# Altium schematic sheet Sheet1.SchDoc
size 420 x 297 mm; Address1: Address1; Address2: Address2; Address3: Address3; Address4: Address4; SheetNumber: 1; Scale: 1:1; Разраб.: Иванов; Обозначение документа: АБВГ.123456.001 Э3; Пров.: Петров; Утв.: Сидоров; Наименование организации: ОАО "Ваша фирма"; Перв. применение: АБВГ.123456.000; Наименование изделия 1: Плата; Наименование изделия 2: Схема электрическая; Наименование изделия 3: принципиальная; Нач. отд.: Нач. отд.; Фамилия нач. отд.: Сидоров; PageSetup: Record=PageOptions|CenterHorizontal=True|CenterVertical=True|PrintScale=0.94|XCorrection=1.00|YCorrection=1.00|PrintKind=1|BorderSize=5000000|LeftOffset=0|BottomOffset=0|Orientation=1|PaperLength=1000|PaperWidth=1000|Scale=100|PaperSource=7|PrintQuality=-4|MediaType=1|DitherType=10|PaperKind=A4|PrintScaleMode=1; DecimalNumber: Децимальный номер; HeadOfSector: Нач. сектора; MainDevice: Перв.примен.; Name: Наименование
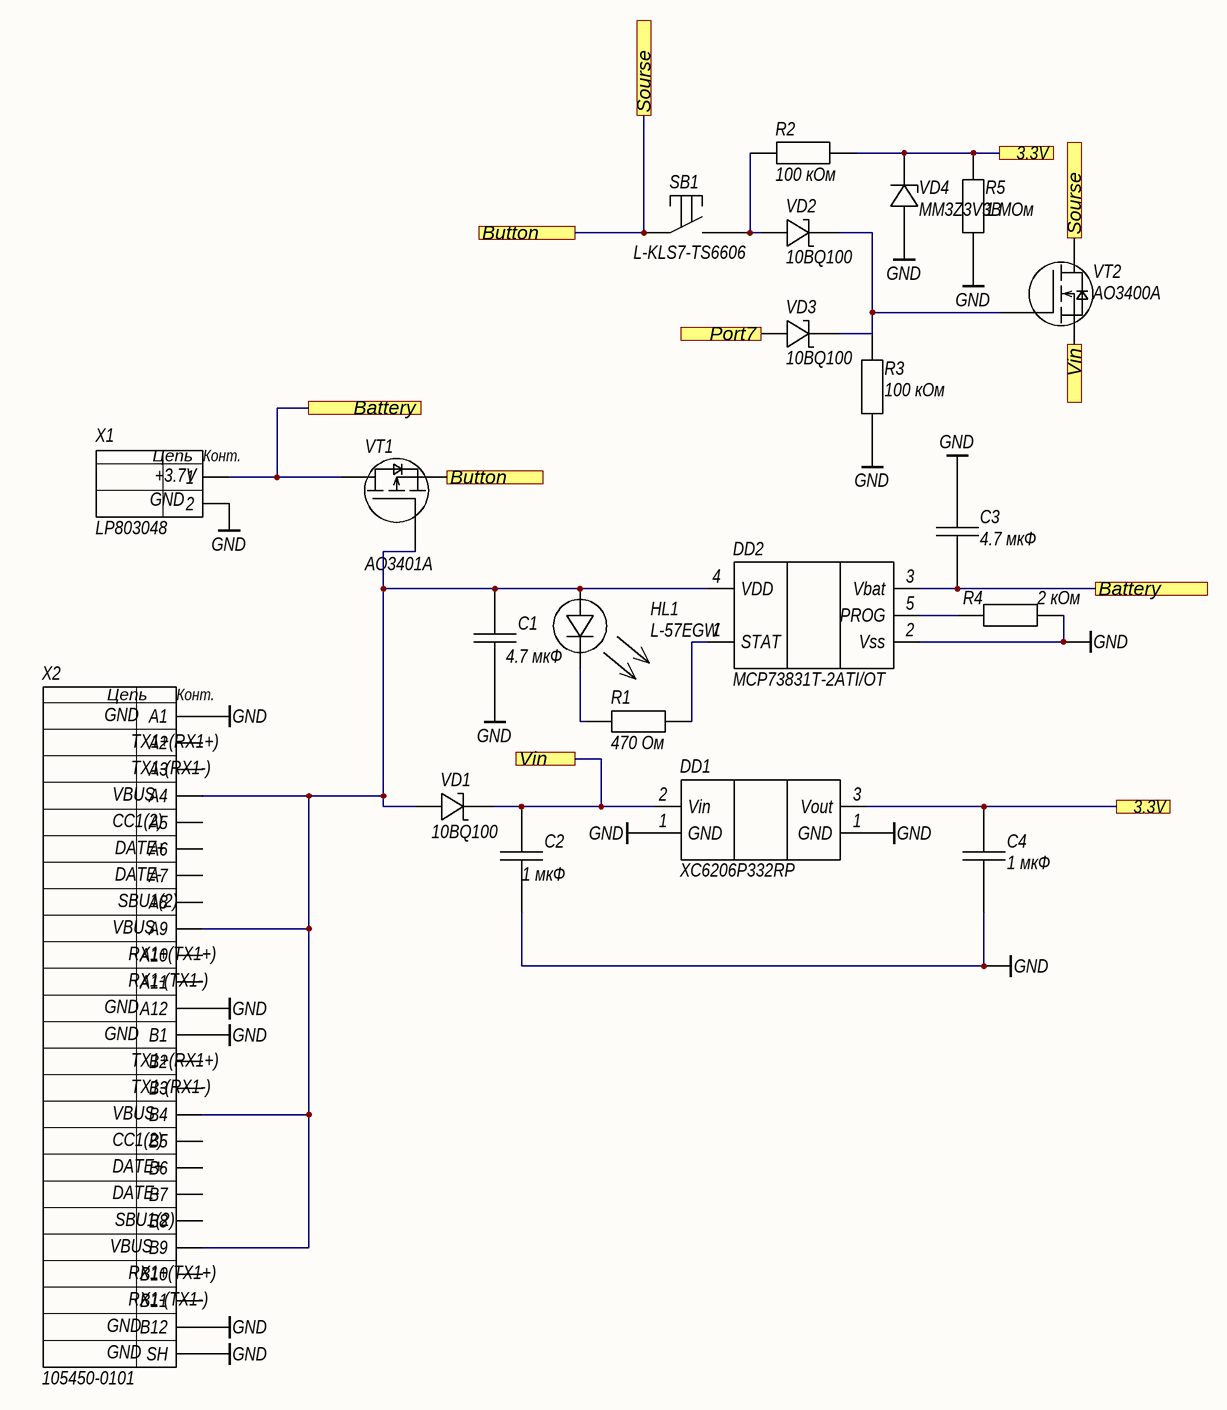
[diagram p0: Sheet1.SchDoc]

## Parts
C1  4.7 мкФ  [CAP_0805]
C2  1 мкФ  [CAP_0805]
C3  4.7 мкФ  [CAP_0805]
C4  1 мкФ  [CAP_0805]
DD1  XC6206P332RP  [SOT-89]
DD2  MCP73831T-2ATI/OT  [SOT-23-5]
HL1  L-57EGW  [LED]
R1  470 Ом  [RES_0603]
R2  100 кОм  [RES_0603]
R3  100 кОм  [RES_0603]
R4  2 кОм  [RES_0603]
R5  1 МОм  [RES_0603]
SB1  L-KLS7-TS6606  [Button]
VD1  10BQ100  [SMB(DIODE)]
VD2  10BQ100  [SMB(DIODE)]
VD3  10BQ100  [SMB(DIODE)]
VD4  MM3Z3V3B  [SOD-323F]
VT1  AO3401A  [SOT-23-3]
VT2  AO3400A  [SOT-23-3]
X1  LP803048  [Raziem2_3mm]
X2  105450-0101  [USB-C]

## Ports
3.3V, Battery, Button, Port7, Sourse, Vin

## Nets
GND: C1.2 C2.2 C3.1 C4.2 DD1.1(GND) DD2.2(Vss) R3.1 R4.2 R5.1 VD4.A X1.2 X2.A1 X2.A12 X2.B1 X2.B12 X2.SH
3.3V: C4.1 DD1.3(Vout) R2.2 R5.2 VD4.K ; port 3.3V
Battery: C3.2 DD2.3(Vbat) VT1.DRAIN X1.1 ; port Battery
Button: SB1.1 VT1.SOURCE VT2.DRAIN ; port Sourse, port Button
Port7: VD3.A ; port Port7
Vin: C2.1 DD1.2(Vin) VD1.K VT2.SOURCE ; port Vin
NetC1_1: C1.1 DD2.4(VDD) HL1.A VD1.A VT1.GATE X2.A4 X2.A9 X2.B4 X2.B9
NetDD2_1: DD2.1(STAT) R1.2
NetDD2_5: DD2.5(PROG) R4.1
NetHL1_K: HL1.K R1.1
NetR2_1: R2.1 SB1.2 VD2.A
NetR3_2: R3.2 VD2.K VD3.K VT2.GATE

Not connected (* = marked no-connect by the designer): X2 A2 A3 A5 A6 A7 A8 A10 A11 B2 B3 B5 B6 B7 B8 B10 B11

## Notes on the sheet
- Перв.примен.
- Справ.№
- Подп. и дата
- Инв.№ дубл.
- Взам.инв.№
- Подп.и дата
- Разраб.
- Изм.
- Лист
- № докум.
- Подп.
- Дата
- Лит.
- Масштаб
- Масса
- Т.контр.
- Пров.
- СХЕМА   ЭЛЕКТРИЧЕСКАЯ
- ПРИНЦИПИАЛЬНАЯ
- Листов
- Инв.№ подл.
- Утв.
- Н.контр.
- Нач.сект.
- Формат  A3
- (in symbol Raziem_2KONTKTA) Цепь; Конт.; +3.7V; GND
- (in symbol Raziem_USB-C) Цепь; Конт.; GND; TX1+(RX1+); TX1-(RX1-); VBUS; CC1(2); DATE+; DATE-; SBU1(2); RX1+(TX1+); RX1-(TX1-)

## Library data of the parts
C1-C4 = Condensator
  C1 C3: Value: 4.7 мкФ
  C2 C4: Value: 1 мкФ
DD1 = Stability_power: Name: XC6206P332RP
DD2 = Control_batery: Name: MCP73831T-2ATI/OT
HL1 = Svetodiode: Color: L-57EGW; Name: L-57EGW
R1-R5 = Rezistor
  R1: Value: 470 Ом
  R2 R3: Value: 100 кОм
  R4: Value: 2 кОм
  R5: Value: 1 МОм
SB1 = Button: Name: L-KLS7-TS6606
VD1-VD3 = Diode_SHOTKI: Name: 10BQ100
VD4 = Stabilitron: Name: MM3Z3V3B
VT1 = Polevoy_transistor_P_tip: Name: AO3401A
VT2 = Polevoy_transistor_N_tip: Name: AO3400A
X1 = Raziem_2KONTKTA: Name: LP803048
X2 = Raziem_USB-C: Name: 105450-0101